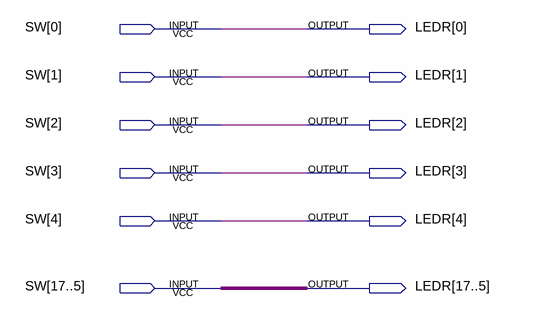
[diagram p0: schematic sheet]
// Quartus schematic Part1.bdf as structural Verilog: 0 symbols, 12 pins
module Part1 (
  input  [17:0] SW,
  output [17:0] LEDR
);


  assign LEDR = SW;
endmodule
